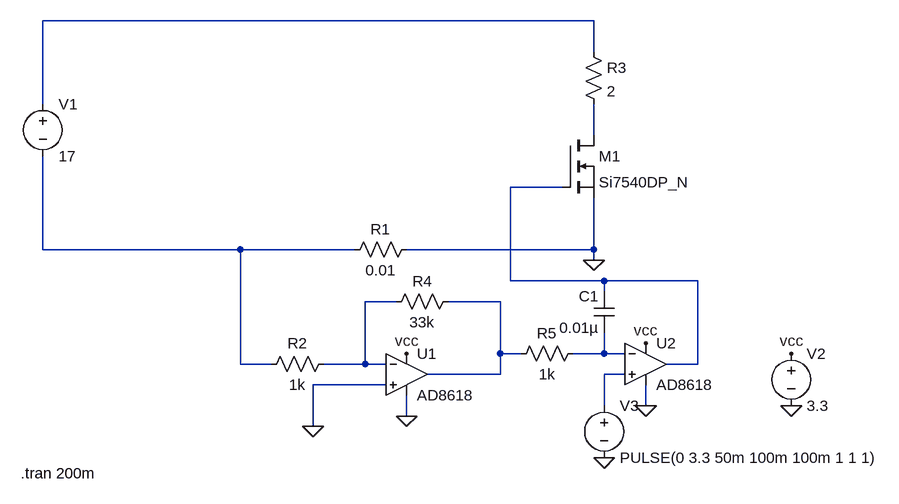
[diagram p0: schematic Solar_Calibrator.asc]
Solar_Calibrator.asc, the LTspice schematic file:
Version 4
SHEET 1 1688 728
WIRE 880 16 32 16
WIRE 880 64 880 16
WIRE 32 144 32 16
WIRE 880 192 880 144
WIRE 832 272 752 272
WIRE 32 368 32 224
WIRE 336 368 32 368
WIRE 512 368 336 368
WIRE 880 368 880 288
WIRE 880 368 592 368
WIRE 880 384 880 368
WIRE 752 416 752 272
WIRE 896 416 752 416
WIRE 1040 416 896 416
WIRE 896 432 896 416
WIRE 576 448 528 448
WIRE 736 448 656 448
WIRE 736 528 736 448
WIRE 768 528 736 528
WIRE 896 528 896 496
WIRE 896 528 848 528
WIRE 928 528 896 528
WIRE 336 544 336 368
WIRE 384 544 336 544
WIRE 528 544 528 448
WIRE 528 544 464 544
WIRE 560 544 528 544
WIRE 1040 544 1040 416
WIRE 1040 544 992 544
WIRE 736 560 736 528
WIRE 736 560 624 560
WIRE 928 560 896 560
WIRE 560 576 448 576
WIRE 896 608 896 560
WIRE 960 608 960 576
WIRE 592 624 592 592
WIRE 448 640 448 576
FLAG 880 384 0
FLAG 592 624 0
FLAG 1184 608 0
FLAG 1184 528 vcc
FLAG 592 528 vcc
FLAG 448 640 0
FLAG 960 608 0
FLAG 960 512 vcc
FLAG 896 688 0
SYMBOL voltage 32 128 R0
SYMATTR InstName V1
SYMATTR Value 17
SYMBOL nmos 832 192 R0
SYMATTR InstName M1
SYMATTR Value Si7540DP_N
SYMBOL res 864 48 R0
SYMATTR InstName R3
SYMATTR Value 2
SYMBOL res 608 352 R90
WINDOW 0 0 56 VBottom 2
WINDOW 3 32 56 VTop 2
SYMATTR InstName R1
SYMATTR Value 0.01
SYMBOL Opamps\\AD8618 592 496 R0
SYMATTR InstName U1
SYMBOL voltage 1184 512 R0
SYMATTR InstName V2
SYMATTR Value 3.3
SYMBOL res 480 528 R90
WINDOW 0 0 56 VBottom 2
WINDOW 3 32 56 VTop 2
SYMATTR InstName R2
SYMATTR Value 1k
SYMBOL res 672 432 R90
WINDOW 0 0 56 VBottom 2
WINDOW 3 32 56 VTop 2
SYMATTR InstName R4
SYMATTR Value 33k
SYMBOL Opamps\\AD8618 960 480 R0
SYMATTR InstName U2
SYMBOL voltage 896 592 R0
WINDOW 123 0 0 Left 0
WINDOW 39 0 0 Left 0
SYMATTR InstName V3
SYMATTR Value PULSE(0 3.3 50m 100m 100m 1 1 1)
SYMBOL cap 912 496 R180
WINDOW 0 24 56 Left 2
WINDOW 3 24 8 Left 2
SYMATTR InstName C1
SYMATTR Value 0.01µ
SYMBOL res 864 512 R90
WINDOW 0 0 56 VBottom 2
WINDOW 3 32 56 VTop 2
SYMATTR InstName R5
SYMATTR Value 1k
TEXT -2 712 Left 2 !.tran 200m

The netlist it stands for:
* Solar_Calibrator.asc
V1 N001 N004 17
M1 N002 N003 0 0 Si7540DP_N
R3 N001 N002 2
R1 0 N004 0.01
XU1 0 N005 vcc 0 N006 AD8618  ; pins In+ In- V+ V- OUT
V2 vcc 0 3.3
R2 N005 N004 1k
R4 N006 N005 33k
XU2 N008 N007 vcc 0 N003 AD8618  ; pins In+ In- V+ V- OUT
V3 N008 0 PULSE(0 3.3 50m 100m 100m 1 1 1)
C1 N007 N003 0.01µ
R5 N007 N006 1k
.model NMOS NMOS
.model PMOS PMOS
.lib standard.mos
.tran 200m
.backanno
.end